# EAGLE design sonic_screwdriver (EAGLE 6.5.0)
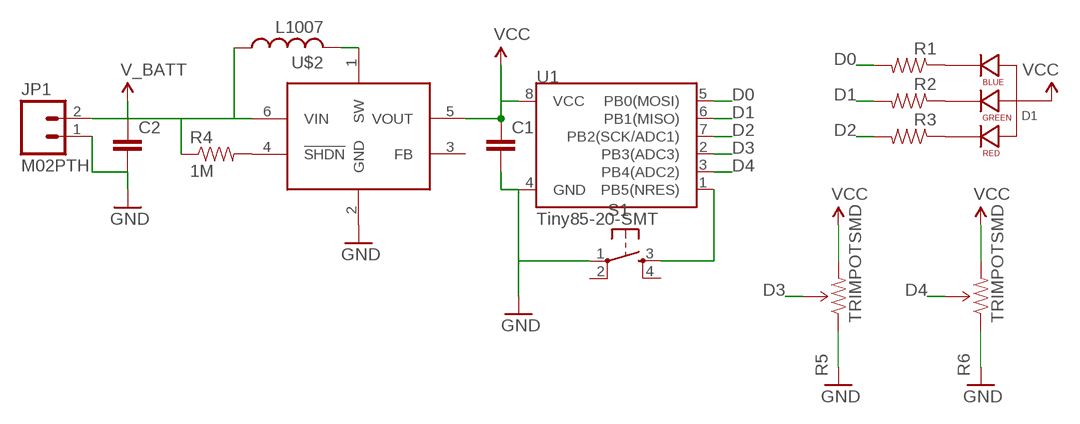
[diagram p0: schematic, sheet 1]

## Parts
C1  CAP1206  [1206]
C2  CAP1206  [1206]
D1  LED-RGB-CA-THRUEDGE  [LED-RGB-EDGE]
JP1  M02PTH  [1X02]
R1  RESISTOR0805-RES  [0805]
R2  RESISTOR0805-RES  [0805]
R3  RESISTOR0805-RES  [0805]
R4  1M  RESISTOR0805-RES  [0805]
R5  TRIMPOTSMD  [TRIMPOT-3MM]
R6  TRIMPOTSMD  [TRIMPOT-3MM]
S1  TAC_SWITCHSMD  [TACTILE-SWITCH-SMD]
U1  Tiny85-20-SMT  ATTINY45TINY85-20-SMT  [SO08-EIAJ]
U$1  AAT1217  [TSOT-23-6]
U$2  L1007  [L1007]

## Nets
D0: R1.2 U1.5(PB0(MOSI))
D1: R2.2 U1.6(PB1(MISO))
D2: R3.2 U1.7(PB2(SCK/ADC1))
D3: R5.2(WIPER) U1.2(PB3(ADC3))
D4: R6.2(WIPER) U1.3(PB4(ADC2))
GND: C1.2 C2.2 JP1.1 R5.1(CCW) R6.1(CCW) S1.1 U1.4(GND) U$1.2(GND)
N$1: D1.4(BLUE_CATHODE) R1.1
N$2: D1.3(GREEN_CATHODE) R2.1
N$3: D1.1(RED_CATHODE) R3.1
N$4: R4.2 U$1.4(!SHDN)
N$6: U$1.1(SW) U$2.P$2
RESET: S1.3 U1.1(PB5(NRES))
V_BATT: C2.1 JP1.2 R4.1 U$1.6(VIN) U$2.P$1
VCC: C1.1 D1.2(ANODE) R5.3(CW) R6.3(CW) U1.8(VCC) U$1.5(VOUT)
Unconnected: S1.2 S1.4 U$1.3(FB)

## Library data of the parts
C1 C2 = barbary_enterprises:CAP: Capacitor Standard 0603 ceramic capacitor, and 0.1" leaded capacitor.
D1 = barbary_enterprises:LED-RGB-CA-THRU: RGB Through-hole common anode SparkFun store front COM-10821 (diffuse) COM-10820 (clear)
JP1 = SparkFun-Connectors:M02: Standard 2-pin 0.1" header. Use with - straight break away headers ( PRT-00116) - right angle break away headers (PRT-00553) - swiss pins (PRT-00743) - machine pins (PRT-00117) - female headers (PRT-00115) Molex polarized connector foot print use with: PRT-08233 with associated crimp pins and housings. 2.54_SCREWTERM for use with PRT-10571. 3.5mm Screw Terminal footprints for PRT-08084 5mm Screw Terminal footprints for use with PRT-08433
R1-R4 = barbary_enterprises:RESISTOR: Resistor Basic schematic elements and footprints for 0603, 1206, and PTH resistors.
R5 R6 = SparkFun-Electromechanical:TRIMPOT: Various small potentiometers for "set-and-forget" applications
S1 = barbary_enterprises:TAC_SWITCH: Momentary Switch Button commonly used for reset or general input. Spark Fun Electronics SKU : COM-00097 SMT- SWCH-08247
U1 = SparkFun-DigitalIC:ATTINY45: Atmel 8-pin 2/4/8kB flash uC; PROD_ID: IC-09092
U$1 = barbary_enterprises:AAT1217
U$2 = barbary_enterprises:L

## Board
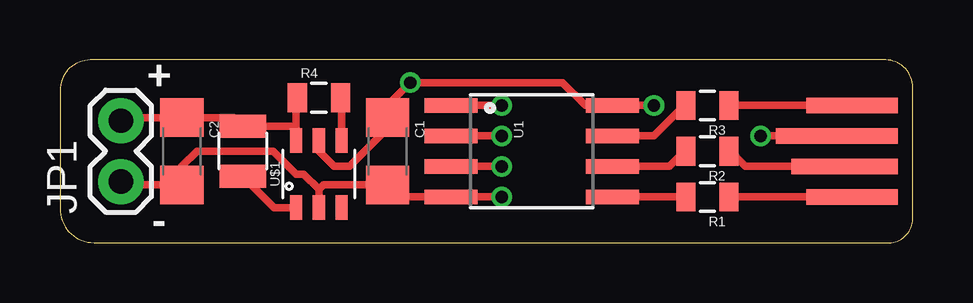
[diagram p1: board, top side]
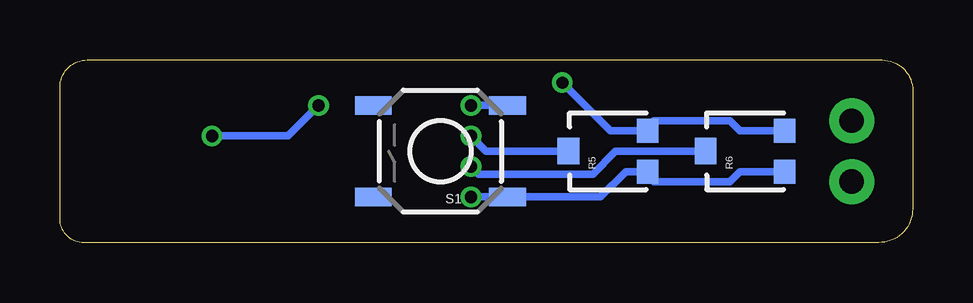
[diagram p2: board, bottom side, seen from below]

Size 35.55 x 7.61 mm. Coordinates in mm from the lower left corner, seen from the top.
Outline: 0,6.34 0,1.42 arc90 1.42,0 34.55,0 arc90 35.55,0.99 35.55,6.48 arc90 34.42,7.61 1.27,7.61 arc90 0,6.34
Copper layers (1*16): Top 0.0356mm / dielectric 1.5011mm / Bottom 0.0356mm
Design rules "LaenPCBOrder": minimum track width 6mil, minimum drill 13mil, track to track 6mil, track to pad 6mil, pad to pad 6mil, via to via 6mil, smd to smd 6mil, copper to edge 15mil, drill to drill 6mil, minimum pad ring 7mil, minimum via ring 7mil, stop-mask expansion 3mil, vias tented up to drill 0mil, thermal gap 10mil

### Footprints (pad centres in the part's own frame; a part is rotated, then mirrored left to right if it is on the bottom)
1206 = smd 1.6 x 1.8: 1 -1.4,0; 2 1.4,0
LED-RGB-EDGE = smd 3.81 x 0.635: 1 -2.54,1.27; 4 -2.54,-2.54 | smd 5.08 x 0.635: 2 -3.175,0 | smd 4.445 x 0.635: 3 -2.857,-1.27
1X02 = drill 1.016 pad 1.88: 1 0,0; 2 2.54,0
0805 = smd 0.8 x 1.2: 1 -0.9,0; 2 0.9,0
TRIMPOT-3MM = smd 1 x 0.9: 1 -0.85,-1.65; 3 0.85,-1.65 | smd 1.1 x 0.9: 2 0,1.65
TACTILE-SWITCH-SMD = smd 1.524 x 0.762: 1 -2.794,1.905; 2 2.794,1.905; 3 -2.794,-1.905; 4 2.794,-1.905
SO08-EIAJ = smd 0.61 x 2.21: 1 -1.905,-3.378; 2 -0.635,-3.378; 3 0.635,-3.378; 4 1.905,-3.378; 5 1.905,3.353; 6 0.635,3.353; 7 -0.635,3.353; 8 -1.905,3.353
TSOT-23-6 = smd 1.016 x 0.508: 1 -1.4,0.95; 2 -1.4,0; 3 -1.4,-0.95; 4 1.4,-0.95; 5 1.4,0; 6 1.4,0.95
L1007 = smd 0.965 x 1.93: P$1 -1.04,0; P$2 1.04,0

### Placement (x,y rotation side)
C1  13.65,3.81 270 top
C2  5.08,3.81 270 top
D1  35.56,4.45 0 top
JP1  2.54,2.54 90 top
R1  26.99,1.91 180 top
R2  26.99,3.81 180 top
R3  26.99,5.71 180 top
R4  10.79,6.03 0 top
R5  12.7,3.81 90 bottom
R6  6.99,3.81 90 bottom
S1  19.68,3.81 180 bottom
U1  19.68,3.81 270 top
U$1  10.79,2.86 90 top
U$2  7.62,3.81 270 top

### Tracks (layer width: path | path; a pad name or v marks a point on that pad's centre or on a via)
D0
  Top 0.305: R1.2 U1.5
D1
  Top 0.305: R2.2 26.04,3.81 25.4,3.17 U1.6
D2
  Top 0.305: R3.2 26.04,5.71 24.77,4.45 U1.7
D3  (via drill 0.51)
  Top 0.305: v18.41,4.45 U1.2
  Bottom 0.305: R5.2 17.78,3.81 v18.41,4.45
D4  (via drill 0.51)
  Top 0.305: v18.41,3.17 U1.3
  Bottom 0.305: R6.2 12.38,3.81 13.34,2.86 18.1,2.86 v18.41,3.17
GND  (via drill 0.51)
  Top 0.305: JP1.1 2.67,2.41 C2.2 5.08,3.17 5.71,3.81 8.89,3.81 9.84,2.86 10.16,2.86 10.79,2.22 | 10.79,2.22 10.98,2.41 C1.2 14.16,1.91 U1.4 v18.41,1.91 | U$1.2 10.79,2.22
  Bottom 0.305: v18.41,1.91 S1.1 13.02,1.91 11.96,2.96 R5.1 10.79,2.54 7.62,2.54 7.2,2.96 R6.1
N$1
  Top 0.305: D1.4 R1.1
N$2
  Top 0.305: R2.1 27.94,3.81 28.57,3.17 D1.3
N$3
  Top 0.305: R3.1 D1.1
N$4
  Top 0.305: U$1.4 11.74,5.98 R4.2
N$6
  Top 0.305: U$1.1 8.93,1.46 U$2.P$2
RESET  (via drill 0.51)
  Top 0.305: U1.1 v18.41,5.71
  Bottom 0.305: S1.3 v18.41,5.71
V_BATT
  Top 0.305: U$1.6 9.85,4.76 | 9.85,4.76 9.85,5.98 R4.1 | JP1.2 2.67,5.21 C2.1 7.26,5.21 U$2.P$1 9.76,4.85 9.85,4.76
VCC  (via drill 0.51)
  Top 0.305: D1.2 v29.21,4.45 | v24.77,5.71 U1.8 21.91,5.71 20.95,6.67 v14.61,6.67 14.29,6.35 13.65,5.71 C1.1 13.65,4.76 12.06,3.17 11.43,3.17 10.79,3.81 U$1.5
  Bottom 0.305: v29.21,4.45 26.04,4.45 v24.77,5.71 | R6.3 7.2,4.66 7.62,5.08 10.79,5.08 R5.3 12.6,4.66 v14.61,6.67

### Text on the board
tPlace: + | -